# Altium project SD_Loger.PrjPCB
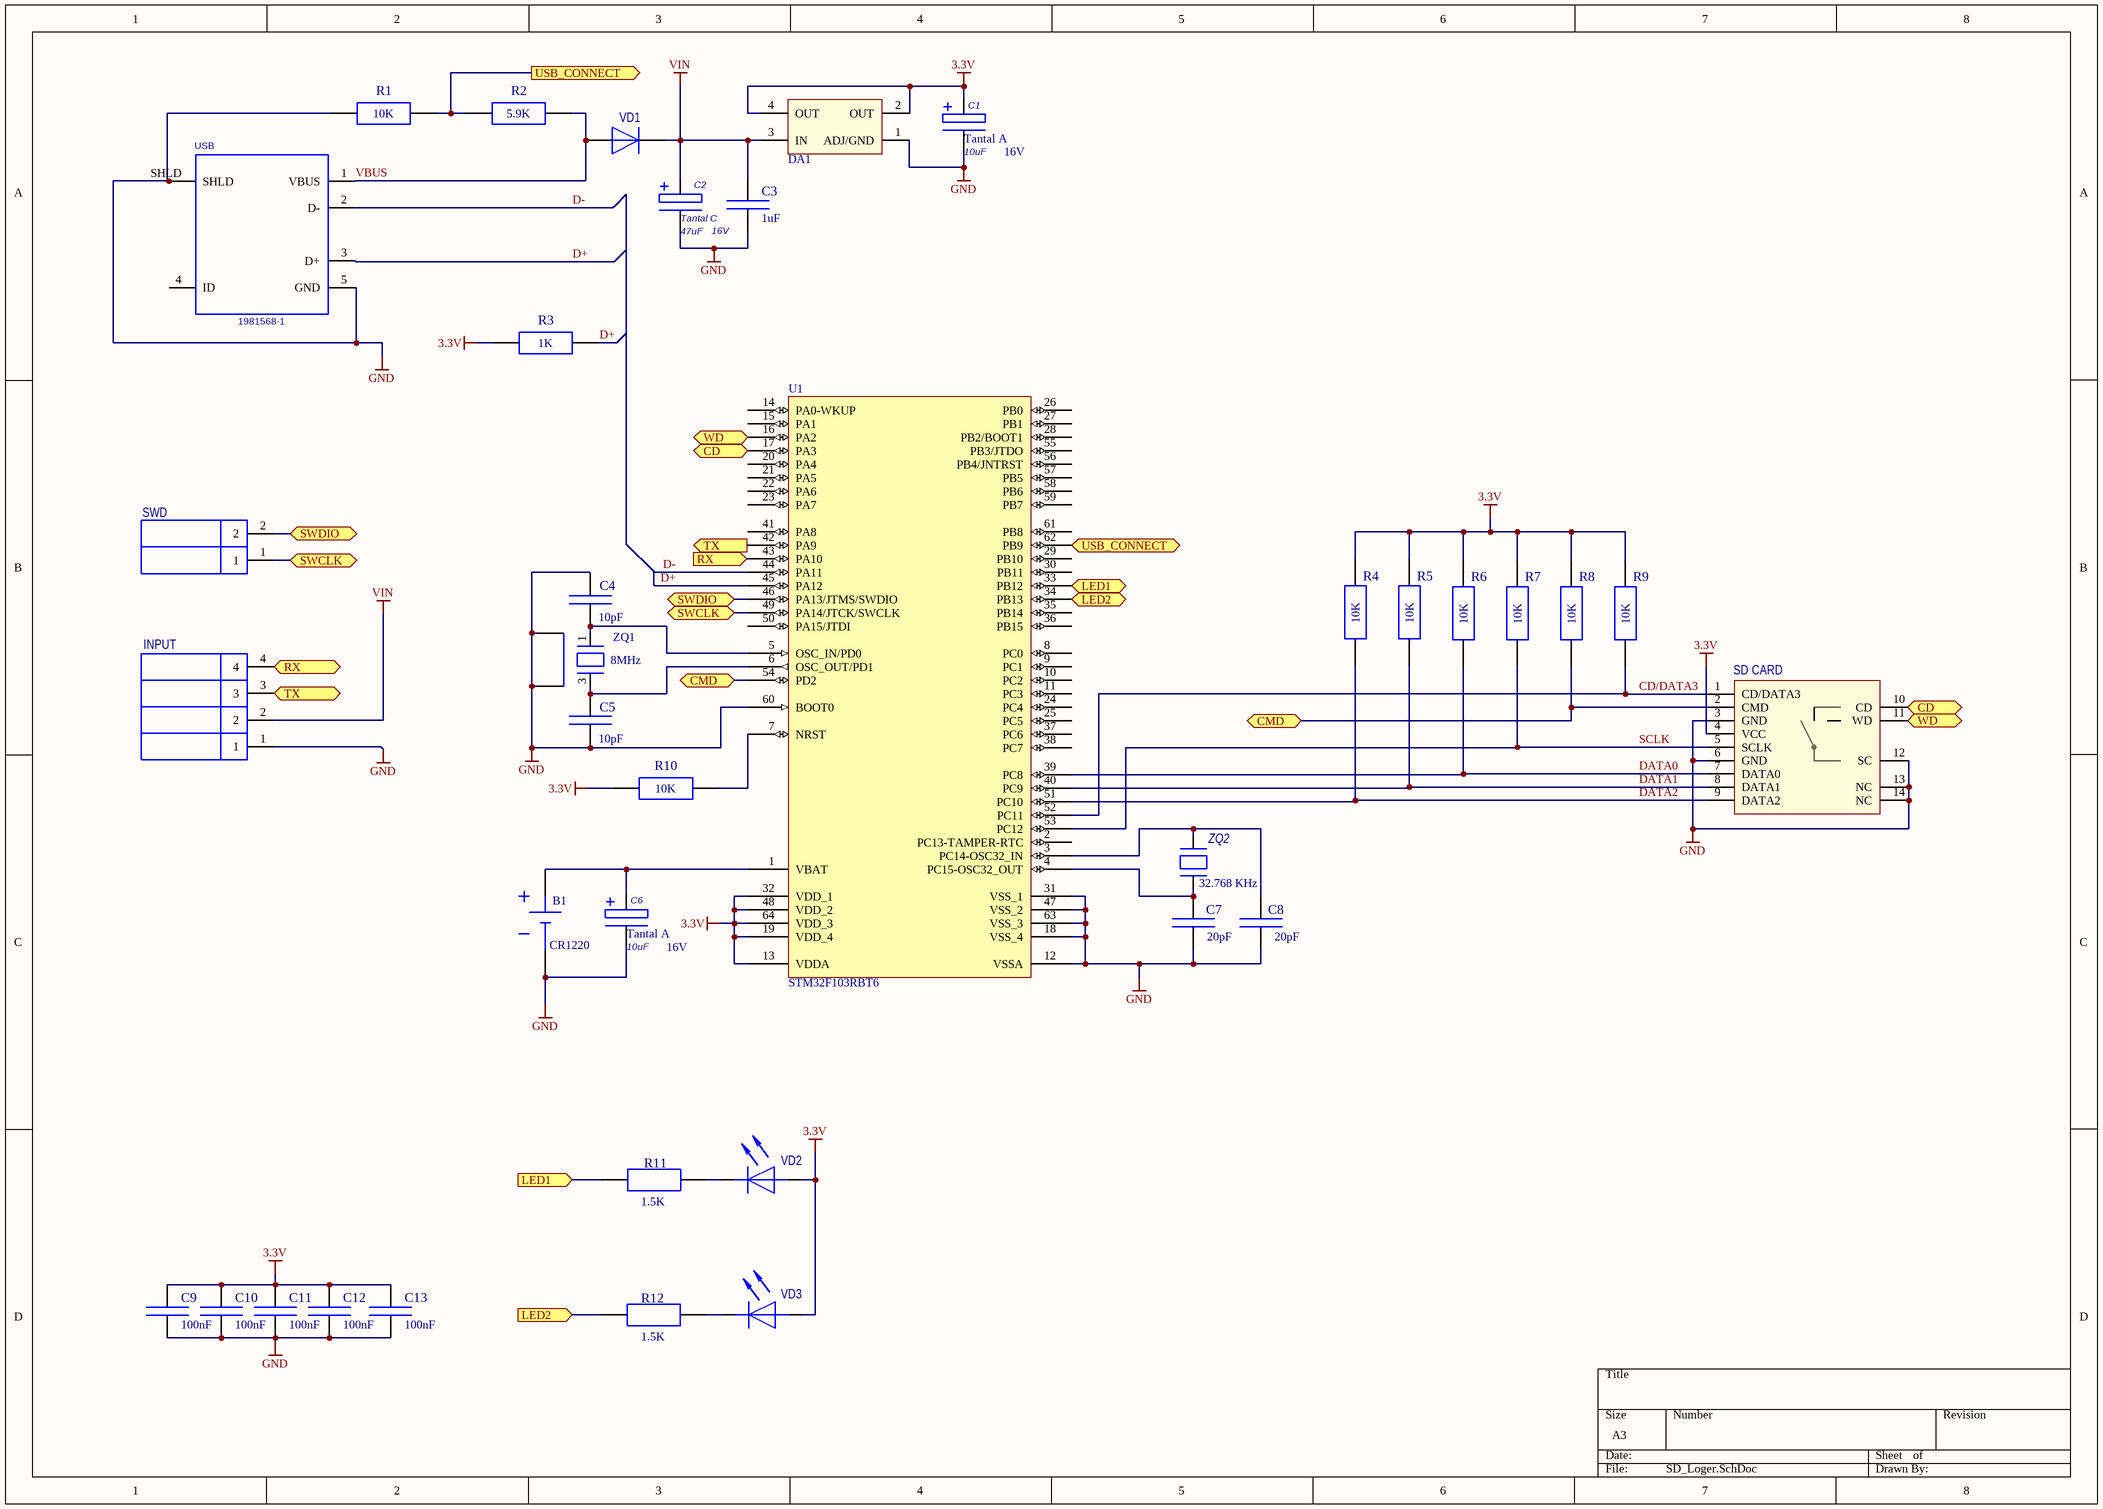
[diagram p0: SD_Loger.SchDoc]
1 sheet, 37 parts. Net scope: flat (ports and power ports of the same name join across sheets).
Board file: SD_Loger.PcbDoc

## Sheet SD_Loger.SchDoc
size A3

### Parts
B1  CR1220  [S8411-45R]
C1  value 10uF  cmpPkg: Tantal A  parVoltage: 16V  [CAPMP3216X180N (TANTAL A)]  (hidden comment: Tantal A 10uF/16V)
C2  value 47uF  cmpPkg: Tantal C  parVoltage: 16V  [CAPMP6033X250N (TANTAL C)]  (hidden comment: Tantal C 47uF/16V)
C3  value 1uF  [CAPC1608X50(0603)]  (hidden comment: чип 0603 1uF/50V,)
C4  value 10pF  [CAPC1608X50(0603)]  (hidden comment: чип 0603 10pF/50V,)
C5  value 10pF  [CAPC1608X50(0603)]  (hidden comment: чип 0603 10pF/50V,)
C6  value 10uF  cmpPkg: Tantal A  parVoltage: 16V  [CAPMP3216X180N (TANTAL A)]  (hidden comment: Tantal A 10uF/16V)
C7  value 20pF  [CAPC1608X50(0603)]  (hidden comment: чип 0603 20pF/50V,)
C8  value 20pF  [CAPC1608X50(0603)]  (hidden comment: чип 0603 20pF/50V,)
C9  value 100nF  [CAPC1608X50(0603)]  (hidden comment: чип 0603 100nF/50V,)
C10  value 100nF  [CAPC1608X50(0603)]  (hidden comment: чип 0603 100nF/50V,)
C11  value 100nF  [CAPC1608X50(0603)]  (hidden comment: чип 0603 100nF/50V,)
C12  value 100nF  [CAPC1608X50(0603)]  (hidden comment: чип 0603 100nF/50V,)
C13  value 100nF  [CAPC1608X50(0603)]  (hidden comment: чип 0603 100nF/50V,)
DA1  AMS1117-3.3  [SOT230P700X180-4N(SOT223)_NUM]  (value not drawn)
INPUT  DS1021-1x4  [HDRV4P254_1x4]  (value not drawn)
R1  value 10K  [RESC1608X45(0603)]  (hidden comment: чип 0603 10K 5%)
R2  value 5.9K  [RESC1608X45(0603)]  (hidden comment: чип 0603 5.9K 5%)
R3  value 1K  [RESC1608X45(0603)]  (hidden comment: чип 0603 1K 5%)
R4  value 10K  [RESC1608X45(0603)]  (hidden comment: чип 0603 10K 5%)
R5  value 10K  [RESC1608X45(0603)]  (hidden comment: чип 0603 10K 5%)
R6  value 10K  [RESC1608X45(0603)]  (hidden comment: чип 0603 10K 5%)
R7  value 10K  [RESC1608X45(0603)]  (hidden comment: чип 0603 10K 5%)
R8  value 10K  [RESC1608X45(0603)]  (hidden comment: чип 0603 10K 5%)
R9  value 10K  [RESC1608X45(0603)]  (hidden comment: чип 0603 10K 5%)
R10  value 10K  [RESC1608X45(0603)]  (hidden comment: чип 0603 10K 5%)
R11  value 1.5K  [RESC1608X45(0603)]  (hidden comment: чип 0603 1.5K 5%)
R12  value 1.5K  [RESC1608X45(0603)]  (hidden comment: чип 0603 1.5K 5%)
SD_CARD  Attend  [Attend 104H-TDA0-R01]  (value not drawn)
SWD  DS1021-1x2  [HEADER-2.54P-2N]  (value not drawn)
U1  STM32F103RBT6  [LQFP64_N]
USB  1981568-1  [USB MICRO-B]
VD1  (SMA)  [DIOM5226X267N (SMA)]  (value not drawn)
VD2  чип 0603 LED (RED)  [LEDC1608X80N(0603)_red]  (value not drawn)
VD3  чип 0603 LED (RED)  [LEDC1608X80N(0603)_red]  (value not drawn)
ZQ1  value 8MHz  [XTAL320X250X78-4N(ADM8)]  (hidden comment: KX-7T-12.88662 12MHz(8MHz))
ZQ2  value 32.768 KHz  [XTAL320X150X90-2N(DST)]  (hidden comment: DST310S(32.768 KHz))

### Ports
CD, CMD, LED1 (in), LED1 (out), LED2 (in), LED2 (out), RX (in), RX (out), SWCLK, SWCLK (bidir), SWDIO, SWDIO (bidir), TX (in), TX (out), USB_CONNECT (in), USB_CONNECT (out), WD

### Nets
3.3V: C1.1 C9.2 C10.2 C11.2 C12.2 C13.2 DA1.2(OUT) DA1.4(OUT) R3.1 R4.2 R5.2 R6.2 R7.2 R8.2 R9.2 R10.1 SD_CARD.4(VCC) U1.13(VDDA) U1.19(VDD_4) U1.32(VDD_1) U1.48(VDD_2) U1.64(VDD_3) VD2.A(anod) VD3.A(anod)
GND: B1.2 C1.2 C2.2(P2) C3.1 C4.2 C5.1 C6.2 C7.1 C8.1 C9.1 C10.1 C11.1 C12.1 C13.1 DA1.1(ADJ/GND) INPUT.1 R1.1 SD_CARD.3(GND) SD_CARD.6(GND) SD_CARD.12(SC) SD_CARD.13(NC) SD_CARD.14(NC) U1.12(VSSA) U1.18(VSS_4) U1.31(VSS_1) U1.47(VSS_2) U1.60(BOOT0) U1.63(VSS_3) USB.5(GND) USB.SHLD ZQ1.2 ZQ1.4
VIN: C2.1(P1) C3.2 DA1.3(IN) INPUT.2 VD1.C
CD/DATA3: R9.1 SD_CARD.1(CD/DATA3) U1.52(PC11)
D+: R3.2 U1.45(PA12) USB.3(D+)
D-: U1.44(PA11) USB.2(D-)
DATA0: R6.1 SD_CARD.7(DATA0) U1.39(PC8)
DATA1: R5.1 SD_CARD.8(DATA1) U1.40(PC9)
DATA2: R4.1 SD_CARD.9(DATA2) U1.51(PC10)
SCLK: R7.1 SD_CARD.5(SCLK) U1.53(PC12)
VBUS: R2.2 USB.1(VBUS) VD1.A
NetB1_1: B1.1 C6.1 U1.1(VBAT)
NetC4_1: C4.1 U1.5(OSC_IN/PD0) ZQ1.1
NetC5_2: C5.2 U1.6(OSC_OUT/PD1) ZQ1.3
NetC7_2: C7.2 U1.4(PC15-OSC32_OUT) ZQ2.2
NetC8_2: C8.2 U1.3(PC14-OSC32_IN) ZQ2.1
NetINPUT_3: INPUT.3 U1.42(PA9) ; port TX
NetINPUT_4: INPUT.4 U1.43(PA10) ; port RX
NetR1_2: R1.2 R2.1 U1.62(PB9) ; port USB_CONNECT
NetR8_1: R8.1 SD_CARD.2(CMD) U1.54(PD2) ; port CMD
NetR10_2: R10.2 U1.7(NRST)
NetR11_1: R11.1 U1.33(PB12) ; port LED1
NetR11_2: R11.2 VD2.C(cathode)
NetR12_1: R12.1 U1.34(PB13) ; port LED2
NetR12_2: R12.2 VD3.C(cathode)
NetSD_CARD_10: SD_CARD.10(CD) U1.17(PA3) ; port CD
NetSD_CARD_11: SD_CARD.11(WD) U1.16(PA2) ; port WD
NetSWD_1: SWD.1 U1.49(PA14/JTCK/SWCLK) ; port SWCLK
NetSWD_2: SWD.2 U1.46(PA13/JTMS/SWDIO) ; port SWDIO

Not connected (* = marked no-connect by the designer): U1 2(PC13-TAMPER-RTC) 8(PC0) 9(PC1) 10(PC2) 11(PC3) 14(PA0-WKUP) 15(PA1) 20(PA4) 21(PA5) 22(PA6) 23(PA7) 24(PC4) 25(PC5) 26(PB0) 27(PB1) 28(PB2/BOOT1) 29(PB10) 30(PB11) 35(PB14) 36(PB15) 37(PC6) 38(PC7) 41(PA8) 50(PA15/JTDI) 55(PB3/JTDO) 56(PB4/JNTRST) 57(PB5) 58(PB6) 59(PB7) 61(PB8); USB 4(ID)

### Library data of the parts
B1 = CR1220: CR-1220 Battery Holder; cmpManufacturer: Panasonic; parVoltage: 3V; parOTemp: -20°C to 60°C; cmpMaterial: Lithium; cmpPkg: Coin Cell; cmpCap: 17mAh; cmpDescription: Panasonic CR1220 (Coin Cell), -20°C to 60°C; cmpPartNum: CR1220; Category: Battery Holder
C1 C6 = Tantalum Size A: cmpDescription: , Tantal A, 10uF , 16V; Category: Конденсатор
C2 = Tantalum Size C: cmpDescription: *, Tantal C, 47uF , 16V; Category: Конденсатор; cmpPartNum: *; parCurrent: *
C3 = C0603: cmpDescription: чип 0603 1uF , 50V, ,; parVoltage: 50V; Category: Конденсатор; cmpPkg: чип 0603
C4 C5 = C0603: cmpDescription: чип 0603 10pF , 50V, ,; parVoltage: 50V; Category: Конденсатор; cmpPkg: чип 0603
C7 C8 = C0603: cmpDescription: чип 0603 20pF , 50V, ,; parVoltage: 50V; Category: Конденсатор; cmpPkg: чип 0603
C9-C13 = C0603: cmpDescription: чип 0603 100nF , 50V, ,; parVoltage: 50V; Category: Конденсатор; cmpPkg: чип 0603
DA1 = AMS1117: AMS1117 Voltage Regulation; cmpManufacturer: Advanced Monolithic Systems; cmpPkg: SOT223; parOTemp: -40°C to 125°C; cmpDescription: Advanced Monolithic Systems AMS1117 (SOT223), -40°C to 125°C; Category: Voltage Regulation; cmpPartNum: AMS1117; Примечание: *; ClassName: *
INPUT = Header-2.54P-4N: IDC разъем 4 контактов. Шаг 2.54мм; cmpManufacturer: Connfly; parType: Straight; cmpDescription: Connfly DS1021-1x4, Header 2.54мм pitch,4 pins, Straight; cmpPinCount: 4; cmpType: Header; Category: Разъем; cmpPartNum: DS1021-1x4; cmpPitch: 2.54мм
R1 R4-R10 = R0603: cmpDescription: чип 0603 10K 5%, 100 мВт, ,; parPwr: 100 мВт; Category: Резистор; cmpPkg: чип 0603; Tolerance: 5%
R2 = R0603: cmpDescription: чип 0603 5.9K 5%, 100 мВт, ,; parPwr: 100 мВт; Category: Резистор; cmpPkg: чип 0603; Tolerance: 5%
R3 = R0603: cmpDescription: чип 0603 1K 5%, 100 мВт, ,; parPwr: 100 мВт; Category: Резистор; cmpPkg: чип 0603; Tolerance: 5%
R11 R12 = R0603: cmpDescription: чип 0603 1.5K 5%, 100 мВт, ,; parPwr: 100 мВт; Category: Резистор; cmpPkg: чип 0603; Tolerance: 5%
SD_CARD = MicroSD Attend: Attend 104H-TDA0-R01; cmpPartNum: DM3CS-SF; cmpManufacturer: Hirose; cmpCategory: Industrial; cmpDescription: Hirose   pitch, pins,; Category: Разъем; Примечание: *
SWD = Header-2.54P-2N: IDC разъем 2 контакта; cmpManufacturer: Connfly; parType: Straight; cmpDescription: Connfly DS1021-1x2, Header 2.54 pitch,2 pins, Straight; cmpPinCount: 2; cmpPitch: 2.54; cmpType: Header; Category: Разъем; cmpPartNum: DS1021-1x2
U1 = STM32F103RBT6: STM32 ARM-based 32-bit MCU with 128 Kbytes Flash, 64-pin LQFP, Industrial Temperature; Published: 30-May-2008; DatasheetVersion: rev6, Mar-2008; PackageVersion: Mar-2008; PackageReference: LQFP64; Publisher: Altium Limited; PackageDescription: 64-Pin Low-Profile Quad Flat Pack, 10 x 10 mm Body, 0.5 mm Pitch (LQFP64); ComponentLink1Description: Manufacturer Link; ComponentLink1URL: www.st.com/stm32; ComponentLink2Description: Datasheet; ComponentLink2URL: http://www.st.com/stonline/products/literature/ds/13587.pdf
USB = USB Micro-B Tyco: USB micro type A. SMT (TE 1981568-1); cmpManufacturer: TE Connectivity; parType: RA, SMT; cmpCategory: Industrial; cmpDescription: TE Connectivity 1981568-1 USB Micro B, RA, SMT; cmpType: USB Micro B; Value: *; Category: Разъем; cmpPartNum: 1981568-1; Supplier 1: Mouser; Supplier 2: Arrow; Supplier 3: Digi-Key; Supplier Part Number 1: 571-1981568-1; Supplier Part Number 2: 48480482S8827272N5665; Supplier Part Number 3: A97800CT-ND
VD1 = SMA Standart: SMA General Pupose Diode; cmpDescription: , General  , SMA; parPd: хххмВт; Category: Диод; cmpPkg: SMA; cmpType: General
VD2 VD3 = LED 0603: cmpDescription: LED 0603, LED RED, чип 0603; parLvTyp: xxмкд; parPd: ххмВт; parVf: хВ; Примечание: *; Category: Диод; cmpPkg: чип 0603; cmpPartNum: LED 0603; parColor: RED; cmpType: LED
ZQ1 = XTAL, SMD, 3.2mm x 2.5mm, 4 pads: KX-7T series; cmpManufacturer: Geyer; cmpDescription: Geyer KX-7T-12.88662 12MHz, (8MHz±100 ppm), 12pF; cmpPkg: SMD, 3.2x2.5 mm; parOTemp: -40°C to 85°C; Tolerance: ±100 ppm; parCl: 12pF; Category: Кварцевый Резонатор; cmpPartNum: KX-7T-12.88662 12MHz
ZQ2 = XTAL, SMD, 3.2mm x 1.5mm, 2 pads: DST310S; cmpManufacturer: Daishinku Corporation; cmpPkg: SMD, 3.2x1.5 mm; parOTemp: -40°C to 85°C; cmpDescription: Daishinku Corporation DST310S, (32.768 KHz), 9pF; parCl: 9pF; Category: Кварцевый Резонатор; cmpPartNum: DST310S